# Altium schematic sheet POWER.SchDoc
size A3; Organization: Altium Limited; Address1: L3, 12a Rodborough Rd; Address2: Frenchs Forest; Address3: NSW; Address4: Australia 2086; DocumentNumber: 2; SheetNumber: 2; SheetTotal: 5
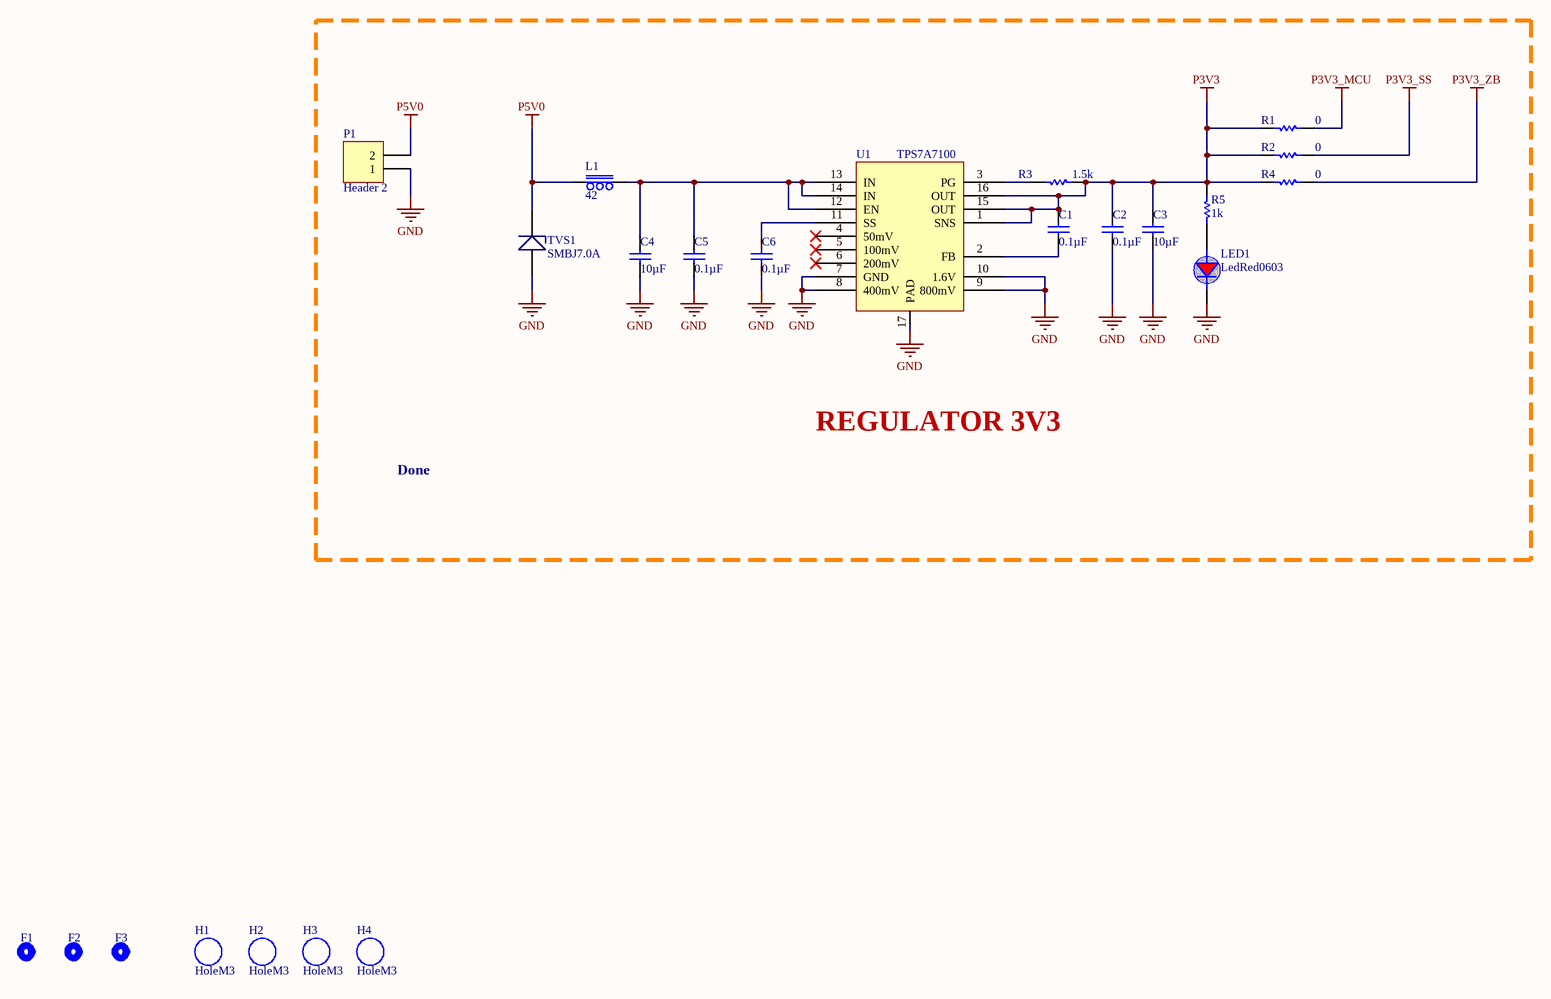
[diagram p0: POWER.SchDoc]

## Parts
C1  0.1µF  [C0402M]
C2  0.1µF  [C0402M]
C3  10µF  [0805 cap]
C4  10µF  [0805 cap]
C5  0.1µF  [C0402M]
C6  0.1µF  [C0402M]
F1  (no value)  [fiducials]
F2  (no value)  [fiducials]
F3  (no value)  [fiducials]
H1  HoleM3  [HOLEM3via]
H2  HoleM3  [HOLEM3via]
H3  HoleM3  [HOLEM3via]
H4  HoleM3  [HOLEM3via]
L1  42  [0805F]
LED1  LedRed0603  [0603LED-RED]
P1  Header 2  [HED2T]
R1  0  [R0805M]
R2  0  [R0805M]
R3  1.5k  [R0603M]
R4  0  [R0805M]
R5  1k  [R0603M]
TVS1  SMBJ7.0A  [DIOM4436X26N]
U1  TPS7A7100  [QFN16]

## Blocks framed on the sheet
REGULATOR 3V3: C1-C6 L1 LED1 P1 R1-R5 TVS1 U1

## Nets
GND: C2.1 C3.1 C4.1 C5.1 C6.1 LED1.2(Katot) P1.1 TVS1.1 U1.7(GND) U1.8(400mV) U1.9(800mV) U1.10(1.6V) U1.17(PAD)
P3V3: C1.2 C2.2 C3.2 R1.1 R2.1 R3.2 R4.1 R5.2 U1.1(SNS) U1.15(OUT) U1.16(OUT)
P3V3_MCU: R1.2
P3V3_SS: R2.2
P3V3_ZB: R4.2
P5V0: L1.1 P1.2 TVS1.2
NetC1_1: C1.1 U1.2(FB)
NetC4_2: C4.2 C5.2 L1.2 U1.12(EN) U1.13(IN) U1.14(IN)
NetC6_2: C6.2 U1.11(SS)
NetLED1_1: LED1.1(anot) R5.1
NetR3_1: R3.1 U1.3(PG)

Not connected (* = marked no-connect by the designer): U1 4(50mV)* 5(100mV)* 6(200mV)*

## Notes on the sheet
- Done
- Title
- Size:
- Date:
- A3
- Number:
- Time:
- Revision:
- Sheet
- of
- File:

## Library data of the parts
C1 C2 C5 C6 = CAP0.1u0402: CAP CER 0.1UF 10V X7R 0402; Manufacturer: Taiyo Yuden; Manufacturer Part Number: LMK105B7104KVHF; Tolerance: ±10%; Supplier 1: Digi-Key; RoHS: RoHS Compliant; Category: Capacitors; Stock 1: 23930; Pricing 1: 1=0.1, 10=0.05, 100=0.0223, 500=0.01594, 1000=0.01252, 2500=0.01138, 5000=0.01047 (USD); Packaging: Cut Tape (CT); Part Status: Active; Capacitance: 0.1µF; Voltage - Rated: 10V; Temperature Coefficient: X7R; Operating Temperature: -55°C ~ 125°C; Features: -; Ratings: AEC-Q200; Applications: Automotive; Mounting Type: Surface Mount, MLCC; Package / Case: 0402 (1005 Metric); Size / Dimension: 0.039" L x 0.020" W (1.00mm x 0.50mm); Height - Seated (Max): -; Thickness (Max): 0.022" (0.55mm); Lead Spacing: -; Lead Style: -; ComponentLink1URL: http://www.yuden.co.jp/productdata/catalog/en/mlcc_all_hq_e.pdf; ComponentLink1Description: http://www.yuden.co.jp/productdata/catalog/en/mlcc_all_hq_e.pdf; Supplier Part Number 1: 587-3769-1-ND
C3 C4 = cap10u0805: CAP CER 10UF 16V X7R 0805; Manufacturer: Taiyo Yuden; Manufacturer Part Number: EMK212BB7106MG-T; Tolerance: ±20%; Supplier 1: Digi-Key; RoHS: RoHS Compliant; Category: Capacitors; Stock 1: 221600; Pricing 1: 1=0.51, 10=0.351, 100=0.2106, 500=0.15798, 1000=0.1334 (USD); Packaging: Cut Tape (CT); Part Status: Active; Capacitance: 10µF; Voltage - Rated: 16V; Temperature Coefficient: X7R; Operating Temperature: -55°C ~ 125°C; Features: -; Ratings: -; Applications: General Purpose; Mounting Type: Surface Mount, MLCC; Package / Case: 0805 (2012 Metric); Size / Dimension: 0.079" L x 0.049" W (2.00mm x 1.25mm); Height - Seated (Max): -; Thickness (Max): 0.053" (1.35mm); Lead Spacing: -; Lead Style: -; ComponentLink1URL: http://www.yuden.co.jp/productdata/catalog/en/mlcc06_e.pdf; ComponentLink1Description: http://www.yuden.co.jp/productdata/catalog/en/mlcc06_e.pdf; Supplier Part Number 1: 587-3319-1-ND
F1-F3 = Fiducials
L1 = Ferrite Bead: FERRITE BEAD 42 OHM 0805 1LN; Manufacturer: Taiyo Yuden; Manufacturer Part Number: FBMJ2125HS420-TV; Filter Type: Power Line; Number of Lines: 1; Impedance @ Frequency: 42 Ohm @ 100MHz; Current Rating (Max): 4A; DC Resistance (DCR) (Max): 8 mOhm; Supplier 1: Digi-Key; Supplier Part Number 1: 587-3851-6-ND; RoHS: RoHS Compliant; Category: Filters; Stock 1: 2013; Pricing 1: 1=0.2, 10=0.154, 25=0.1276, 50=0.11, 100=0.099, 250=0.0836, 500=0.0748, 1000=0.0638 (USD); Packaging: Digi-Reel®; Part Status: Active; Ratings: AEC-Q200; Operating Temperature: -40°C ~ 125°C; Package / Case: 0805 (2012 Metric); Mounting Type: Surface Mount; Height (Max): 0.041" (1.05mm); Size / Dimension: 0.079" L x 0.049" W (2.00mm x 1.25mm); ComponentLink1URL: http://ds.yuden.co.jp/TYCOMPAS/ut/detail.do?productNo=FBMJ2125HS420-TV&fileName=FBMJ2125HS420-TV_SS&mode=specSheetDownload; ComponentLink1Description: http://ds.yuden.co.jp/TYCOMPAS/ut/detail.do?productNo=FBMJ2125HS420-TV&fileName=FBMJ2125HS420-TV_SS&mode=specSheetDownload
LED1 = LedRed0603: LED RED CLEAR 0603 SMD; Manufacturer: Everlight Electronics Co Ltd; Manufacturer Part Number: QTLP600C7TR; Lens Color: Colorless; Millicandela Rating: 20mcd; Lens Style/Size: Rectangle with Flat Top, 1.20mm x 0.80mm; Voltage - Forward (Vf) (Typ): 1.9V; Current - Test: 20mA; Viewing Angle: 100°; Wavelength - Dominant: 645nm; Wavelength - Peak: 660nm; Supplier 1: Digi-Key; RoHS: RoHS Compliant; Category: Optoelectronics; Stock 1: 19325; Pricing 1: 1=0.41, 10=0.297, 25=0.2276, 100=0.1485, 250=0.10892, 500=0.0924, 1000=0.0759 (USD); Packaging: Cut Tape (CT); Part Status: Active; Color: Red; Lens Transparency: Clear; Mounting Type: Surface Mount; Features: -; Package / Case: 0603 (1608 Metric); Size / Dimension: 1.60mm L x 0.80mm W; Height (Max): 0.80mm; ComponentLink1URL: http://media.digikey.com/pdf/Data%20Sheets/Everlight%20PDFs/QTLP600C.pdf; ComponentLink1Description: http://media.digikey.com/pdf/Data%20Sheets/Everlight%20PDFs/QTLP600C.pdf; Supplier Part Number 1: 1080-1400-1-ND
P1 = Header 2: Header, 2-Pin; LatestRevisionDate: 17-Jul-2002; LatestRevisionNote: Re-released for DXP Platform.; Publisher: Altium Limited
R1 R2 R4 = RES00805: RES SMD 0.0 OHM JUMPER 1/8W 0805; Manufacturer: Panasonic Electronic Components; Manufacturer Part Number: ERJ-6GEY0R00V; Resistance (Ohms): 0.0; Power (Watts): 0.125W, 1/8W; Supplier 1: Digi-Key; RoHS: RoHS Compliant; Category: Resistors; Stock 1: 562130; Pricing 1: 1=0.1, 10=0.024, 25=0.0172, 50=0.0132, 100=0.0097, 250=0.00744, 500=0.00594, 1000=0.00437 (USD); Packaging: Cut Tape (CT); Part Status: Active; Tolerance: Jumper; Composition: Thick Film; Features: Automotive AEC-Q200; Temperature Coefficient: -; Operating Temperature: -55°C ~ 155°C; Package / Case: 0805 (2012 Metric); Supplier Device Package: 0805; Size / Dimension: 0.079" L x 0.049" W (2.00mm x 1.25mm); Height - Seated (Max): 0.028" (0.70mm); Failure Rate: -; ComponentLink1URL: http://industrial.panasonic.com/www-cgi/jvcr13pz.cgi?E+PZ+3+AOA0001+ERJ6GEY0R00V+7+WW; ComponentLink1Description: http://industrial.panasonic.com/www-cgi/jvcr13pz.cgi?E+PZ+3+AOA0001+ERJ6GEY0R00V+7+WW; Supplier Part Number 1: P0.0ACT-ND
R3 = RES1k50603: RES SMD 1.5K OHM 1% 1/10W 0603; Manufacturer: Panasonic Electronic Components; Manufacturer Part Number: ERJ-3EKF1501V; Power (Watts): 0.1W, 1/10W; Temperature Coefficient: ±100ppm/°C; Supplier 1: Digi-Key; RoHS: RoHS Compliant; Category: Resistors; Stock 1: 0; Pricing 1: 1=0.1, 10=0.021, 100=0.0087, 1000=0.00389, 2500=0.00338 (USD); Packaging: Cut Tape (CT); Part Status: Active; Resistance (Ohms): 1.5k; Tolerance: ±1%; Composition: Thick Film; Features: Automotive AEC-Q200; Operating Temperature: -55°C ~ 155°C; Package / Case: 0603 (1608 Metric); Supplier Device Package: 0603; Size / Dimension: 0.063" L x 0.031" W (1.60mm x 0.80mm); Height - Seated (Max): 0.022" (0.55mm); Failure Rate: -; ComponentLink1URL: https://industrial.panasonic.com/cdbs/www-data/pdf/RDA0000/AOA0000C298.pdf; ComponentLink1Description: https://industrial.panasonic.com/cdbs/www-data/pdf/RDA0000/AOA0000C298.pdf; Supplier Part Number 1: P1.50KHCT-ND
R5 = RES1k0603: RES SMD 1K OHM 1% 1/10W 0603; Manufacturer: Panasonic Electronic Components; Manufacturer Part Number: ERJ-3EKF1001V; Power (Watts): 0.1W, 1/10W; Temperature Coefficient: ±100ppm/°C; Supplier 1: Digi-Key; RoHS: RoHS Compliant; Category: Resistors; Stock 1: 0; Pricing 1: 1=0.1, 10=0.021, 100=0.0087, 1000=0.00389, 2500=0.00338 (USD); Packaging: Digi-Reel®; Part Status: Active; Resistance (Ohms): 1k; Tolerance: ±1%; Composition: Thick Film; Features: Automotive AEC-Q200; Operating Temperature: -55°C ~ 155°C; Package / Case: 0603 (1608 Metric); Supplier Device Package: 0603; Size / Dimension: 0.063" L x 0.031" W (1.60mm x 0.80mm); Height - Seated (Max): 0.022" (0.55mm); Failure Rate: -; ComponentLink1URL: https://industrial.panasonic.com/cdbs/www-data/pdf/RDA0000/AOA0000C298.pdf; ComponentLink1Description: https://industrial.panasonic.com/cdbs/www-data/pdf/RDA0000/AOA0000C298.pdf; Supplier Part Number 1: P1.00KHDKR-ND
TVS1 = TVS: TVS DIODE 7V 12V DO214AA; Manufacturer 1: Littelfuse Inc.; Category 1: Circuit Protection; Voltage - Breakdown (Min): 7.78V; Current - Peak Pulse (10/1000µs): 50A; Power - Peak Pulse: 600W; Power Line Protection: No; Supplier 1: Digi-Key; Manufacturer Part Number 1: SMBJ7.0A; RoHS 1: RoHS Compliant; Description 1: TVS DIODE 7V 12V DO214AA; Stock 1: 18983; Pricing 1: 1=0.42, 10=0.327, 25=0.2756, 100=0.2244, 250=0.18588, 500=0.15384, 1000=0.11538 (USD); Packaging: Cut Tape (CT); Part Status: Active; Type: Zener; Voltage - Reverse Standoff (Typ): 7V; Voltage - Clamping (Max) @ Ipp: 12V; Applications: General Purpose; Capacitance @ Frequency: -; Operating Temperature: -65°C ~ 150°C (TJ); Mounting Type: Surface Mount; Package / Case: DO-214AA, SMB; Supplier Device Package: DO-214AA (SMBJ); ComponentLink1URL: http://www.littelfuse.com/~/media/electronics/datasheets/tvs_diodes/littelfuse_tvs_diode_smbj_datasheet.pdf.pdf; ComponentLink1Description: http://www.littelfuse.com/~/media/electronics/datasheets/tvs_diodes/littelfuse_tvs_diode_smbj_datasheet.pdf.pdf; Supplier Part Number 1: SMBJ7.0ALFCT-ND
U1 = TPS7A7100: IC REG LDO FIX/ADJ 1A 16QFN; Manufacturer: Texas Instruments; Manufacturer Part Number: TPS7A7100RGTR; Regulator Topology: Positive Fixed or Adjustable; Voltage - Output: 0.9 V ~ 5 V; Voltage - Input: 1.425 V ~ 6.5 V; Current - Limit (Min): 1.1A; Supplier 1: Digi-Key; RoHS: RoHS Compliant; Category: Integrated Circuits (ICs); Stock 1: 5133; Pricing 1: 1=2.19, 10=1.965, 100=1.5796, 500=1.2978, 1000=1.07532 (USD); Packaging: Cut Tape (CT); Part Status: Active; Current - Output: 1A; Voltage - Dropout (Typical): -; Operating Temperature: -40°C ~ 125°C; Mounting Type: Surface Mount; Package / Case: 16-VFQFN Exposed Pad; Supplier Device Package: 16-QFN (3x3); ComponentLink1URL: http://www.ti.com/lit/ds/symlink/tps7a7100.pdf; ComponentLink1Description: http://www.ti.com/lit/ds/symlink/tps7a7100.pdf; Supplier Part Number 1: 296-40978-1-ND